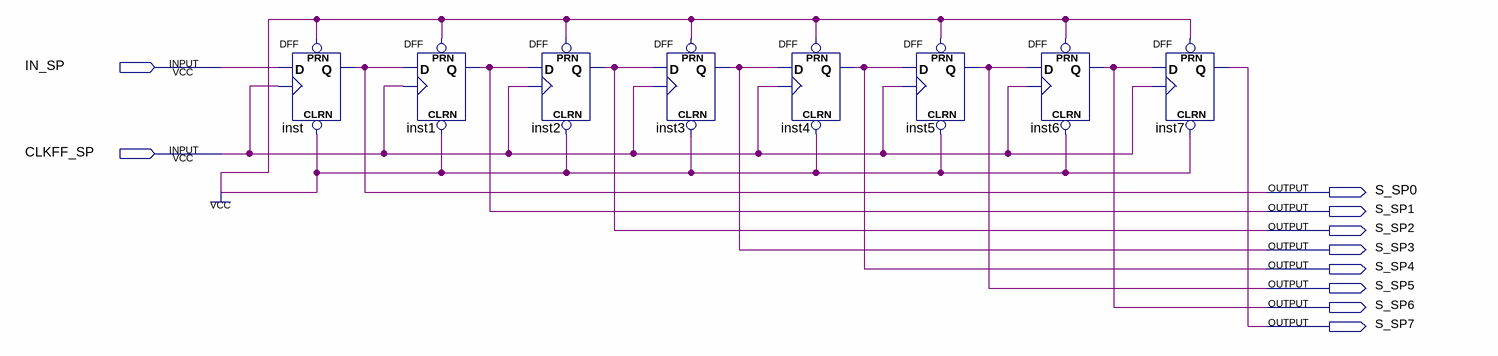
[diagram p0: schematic sheet]
// Quartus schematic SIPO.bdf as structural Verilog: 8 symbols, 10 pins
module SIPO (
  input  IN_SP,
  input  CLKFF_SP,
  output S_SP0,
  output S_SP1,
  output S_SP2,
  output S_SP3,
  output S_SP4,
  output S_SP5,
  output S_SP6,
  output S_SP7
);

  DFF inst (.CLRN(1'b1), .CLK(CLKFF_SP), .D(IN_SP), .PRN(1'b1), .Q(S_SP0));
  DFF inst1 (.CLRN(1'b1), .CLK(CLKFF_SP), .D(S_SP0), .PRN(1'b1), .Q(S_SP1));
  DFF inst2 (.CLRN(1'b1), .CLK(CLKFF_SP), .D(S_SP1), .PRN(1'b1), .Q(S_SP2));
  DFF inst3 (.CLRN(1'b1), .CLK(CLKFF_SP), .D(S_SP2), .PRN(1'b1), .Q(S_SP3));
  DFF inst4 (.CLRN(1'b1), .CLK(CLKFF_SP), .D(S_SP3), .PRN(1'b1), .Q(S_SP4));
  DFF inst5 (.CLRN(1'b1), .CLK(CLKFF_SP), .D(S_SP4), .PRN(1'b1), .Q(S_SP5));
  DFF inst6 (.CLRN(1'b1), .CLK(CLKFF_SP), .D(S_SP5), .PRN(1'b1), .Q(S_SP6));
  DFF inst7 (.CLRN(1'b1), .CLK(CLKFF_SP), .D(S_SP6), .PRN(1'b1), .Q(S_SP7));
endmodule
